# Altium schematic sheet Sheet1.SchDoc
size A4; SheetNumber: 2; SheetTotal: 2
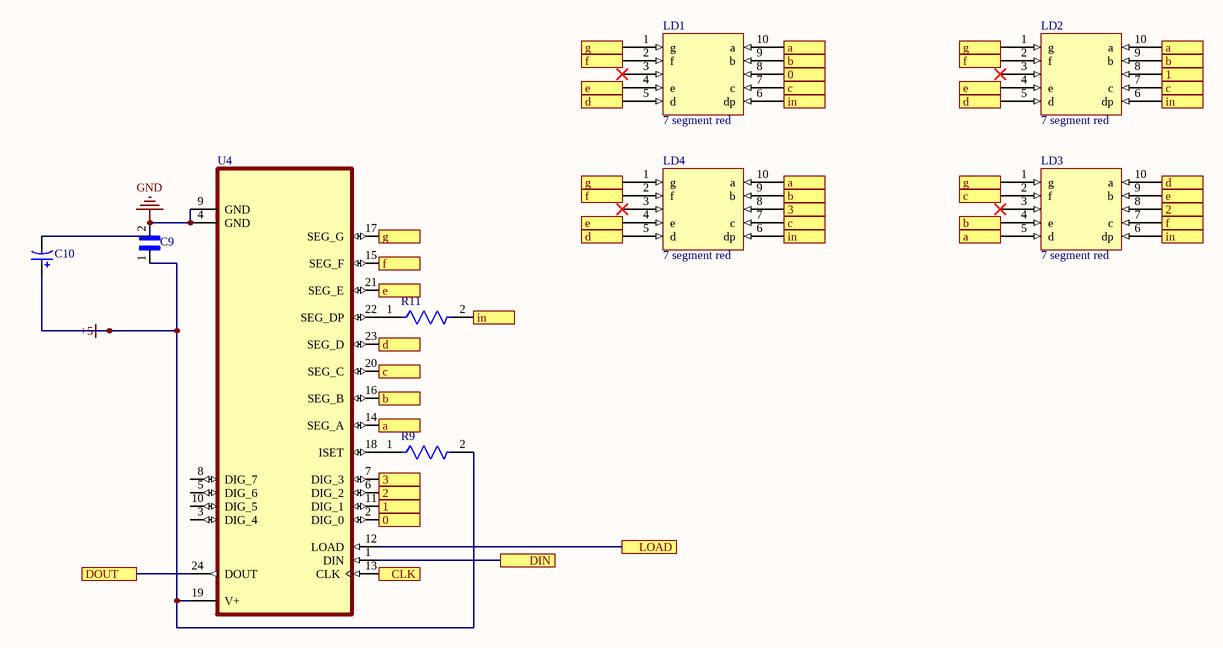
[diagram p0: Sheet1.SchDoc]

## Parts
C9  1206J0630104MXT  [C1206]  (value not drawn)
C10  T491B106M016AT  [KEMT-T491-B_L]  (value not drawn)
LD1  7 segment red  [7 segment]
LD2  7 segment red  [7 segment]
LD3  7 segment red  [7 segment]
LD4  7 segment red  [7 segment]
R9  CRCW120627K0JNEA  [J1-0603]  (value not drawn)
R11  CRCW1206330RFKEA  [J1-0603]  (value not drawn)
U4  MAX7219ENG  [DIP-8]  (value not drawn)

## Ports
0, 1, 2, 3, a, b, c, CLK, d, DIN, DOUT, e, f, g, in, LOAD

## Nets
+5: C9.1 C10.1 R9.2 U4.19(V+)
GND: C9.2 C10.2 U4.4(GND) U4.9(GND)
0: LD1.8 U4.2(DIG_0) ; port 0
1: LD2.8 U4.11(DIG_1) ; port 1
2: LD3.8 U4.6(DIG_2) ; port 2
3: LD4.8 U4.7(DIG_3) ; port 3
a: LD1.10(a) LD2.10(a) LD3.5(d) LD4.10(a) U4.14(SEG_A) ; port a
b: LD1.9(b) LD2.9(b) LD3.4(e) LD4.9(b) U4.16(SEG_B) ; port b
c: LD1.7(c) LD2.7(c) LD3.2(f) LD4.7(c) U4.20(SEG_C) ; port c
CLK: U4.13(CLK) ; port CLK
d: LD1.5(d) LD2.5(d) LD3.10(a) LD4.5(d) U4.23(SEG_D) ; port d
DIN: U4.1(DIN) ; port DIN
DOUT: U4.24(DOUT) ; port DOUT
e: LD1.4(e) LD2.4(e) LD3.9(b) LD4.4(e) U4.21(SEG_E) ; port e
f: LD1.2(f) LD2.2(f) LD3.7(c) LD4.2(f) U4.15(SEG_F) ; port f
g: LD1.1(g) LD2.1(g) LD3.1(g) LD4.1(g) U4.17(SEG_G) ; port g
in: LD1.6(dp) LD2.6(dp) LD3.6(dp) LD4.6(dp) R11.2 ; port in
LOAD: U4.12(LOAD) ; port LOAD
NetR9_1: R9.1 U4.18(ISET)
NetR11_1: R11.1 U4.22(SEG_DP)

Not connected (* = marked no-connect by the designer): LD1 3*; LD2 3*; LD3 3*; LD4 3*; U4 3(DIG_4) 5(DIG_6) 8(DIG_7) 10(DIG_5)

## Library data of the parts
C9 = 100nf 63v ceramic capacitor: 63V Ceramic Capacitor; MF: Knowles Syfer; MP: 1206J0630104MXT; SnapEDA_Link: https://www.snapeda.com/parts/1206J0630104MXT/Knowles%20Syfer/view-part/4314687/?ref=snap; DigiKey-Purchase-URL: https://snapeda.com/shop?store=DigiKey&id=4314687; Mouser-Purchase-URL: https://snapeda.com/shop?store=Mouser&id=4314687; Value: *; Digi-Key_Part_Number: 1608-1392-1-ND; Package: 3216 Knowles Syfer
C10 = 10uf 16v electro capacitor: Tantalum Surface Mount Capacitor, 10 uF, +/- 20%, 16 V, -55 to 125 degC, 2-Pin SMD, RoHS, Tape and Reel; Manufacturer: Kemet; DF: 6%; Product Diameter (mm): NotRequiredmm; ESR: 2.8ohm; Capacitance: 10000000pF; Insulation: NotRequired; Rad Hardened: No; Polarity: Polar; Case Style: Molded; Product Depth (mm): 2.8mm; Product Length (mm): 3.5mm; Voltage: 16VDC; DCL: 1.6uA; Product Height (mm): 1.9mm; Mounting Technology: SurfaceMount; Package Reference: T491-B; Datasheet URL: http://www.kemet.com/Lists/ProductCatalog/Attachments/254/KEM_T2005_T491.pdf; Construction: SMTChip; Package / Case: 3528-21; Length W/Weld: NotRequiredmm; Seated Plane Height: NotRequiredmm; Datasheet Version: 06/2016; Seal: NotRequired; Mounting Style: SurfaceMount; Failure Rate: NotRequired; Operating Temp Range: -55Cto125C; Manufacturer URL: http://www.kemet.com/; Tolerance (+ or -): 20%; Case Code: B; Packaging: TapeandReel; Lead Spacing (nom): NotRequiredmm; Length W/Weld (max): NotRequiredmm; Package Description: 2-Pin Surface Mount Device, Body 3.5 x 2.8 mm; Wire Form: NotRequired; Manufacturer: KEMET; Manufacturer Part Number: T491B106M016AT
R9 = 27kohm resistor: RES Thick Film, 27kΩ, 5%, 0.25W, 200ppm/°C, 1206; Manufacturer: Vishay Dale; Manufacturer Part Number: CRCW120627K0JNTA; Manufacturer: Yageo; Manufacturer Part Number: RC1206JR-0727KL; Manufacturer Part Number: CRCW120627K0JNEB; Manufacturer: Bourns; Manufacturer Part Number: CR1206-JW-273ELF; Manufacturer: Rohm; Manufacturer Part Number: MCR18EZPJ273; Manufacturer: Panasonic; Manufacturer Part Number: ERJ-8GEYJ273V; Power Rating: 250mW; Voltage Rating: 200V; Resistance: 27kR; Packaging: Tape and Reel; Number of Terminations: 2; Case Code (Metric): 3216; Temperature Coefficient: 200ppm/°C; Width: 1.6mm; Depth: 1.6mm; Height: 0.024inch; Min Operating Temperature: -55°C; Composition: Thick Film; Length: 3.2mm; Lead Free: Lead Free; Features: Automotive AEC-Q200; Case Code (Imperial): 1206; Radiation Hardening: No; Contact Plating: Tin; Case/Package: 1206; Weight: 0.000353oz; Military Standard: Not; Max Operating Temperature: 155°C; Voltage Rating (DC): 200V; Termination: SMD/SMT; Number of Pins: 2; Package Quantity: 1; Max Power Dissipation: 250mW; Tolerance: 5%; Manufacturer Part Number: CRCW120627K0JNEA
R11 = 330 ohm resistor: RES Thick Film, 330Ω, 1%, 0.25W, 100ppm/°C, 1206; Manufacturer: Vishay; Voltage Rating: 200V; Resistance: 330R; Max Power Dissipation: 250mW; Height: 0.55mm; Mount: Surface Mount; Min Operating Temperature: -55°C; Depth: 1.6mm; Features: Automotive AEC-Q200; Voltage Rating (DC): 200V; Military Standard: Not; Packaging: Tape and Reel; Composition: Thick Film; Contact Plating: Tin; Case Code (Imperial): 1206; Case/Package: 1206; Number of Terminations: 2; Length: 3.2mm; Lead Free: Lead Free; Tolerance: 1%; Temperature Coefficient: 100ppm/°C; Case Code (Metric): 3216; Width: 1.6mm; Weight: 0.000353oz; Termination: SMD/SMT; Radiation Hardening: No; Package Quantity: 10; Power Rating: 250mW; Max Operating Temperature: 155°C; Manufacturer Part Number: CRCW1206330RFKEA
U4 = 8 digit sisplay driver: 8 digit display; MF: Maxim Integrated; Price: None; Package: DIP-24 Maxim Integrated; Value: *; MP: MAX7219ENG; Availability: Unavailable; SnapEDA_Link: https://www.snapeda.com/parts/MAX7219ENG/Maxim%20Integrated/view-part/1189180/?ref=snap